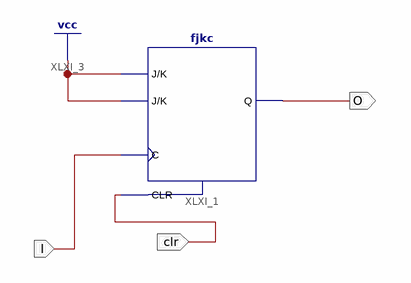
[diagram p0: schematic sheet 1]
// Xilinx ISE schematic mod2.sch (spartan6) as structural Verilog: 1 symbols, 3 ports
module mod2 (
  input  I,
  input  clr,
  output O
);

  fjkc XLXI_1 (.C(I), .CLR(clr), .J(1'b1), .K(1'b1), .Q(O));
endmodule
